# Altium schematic sheet nanobox_v31.SchDoc
size A; SheetNumber: 1; SheetTotal: 1
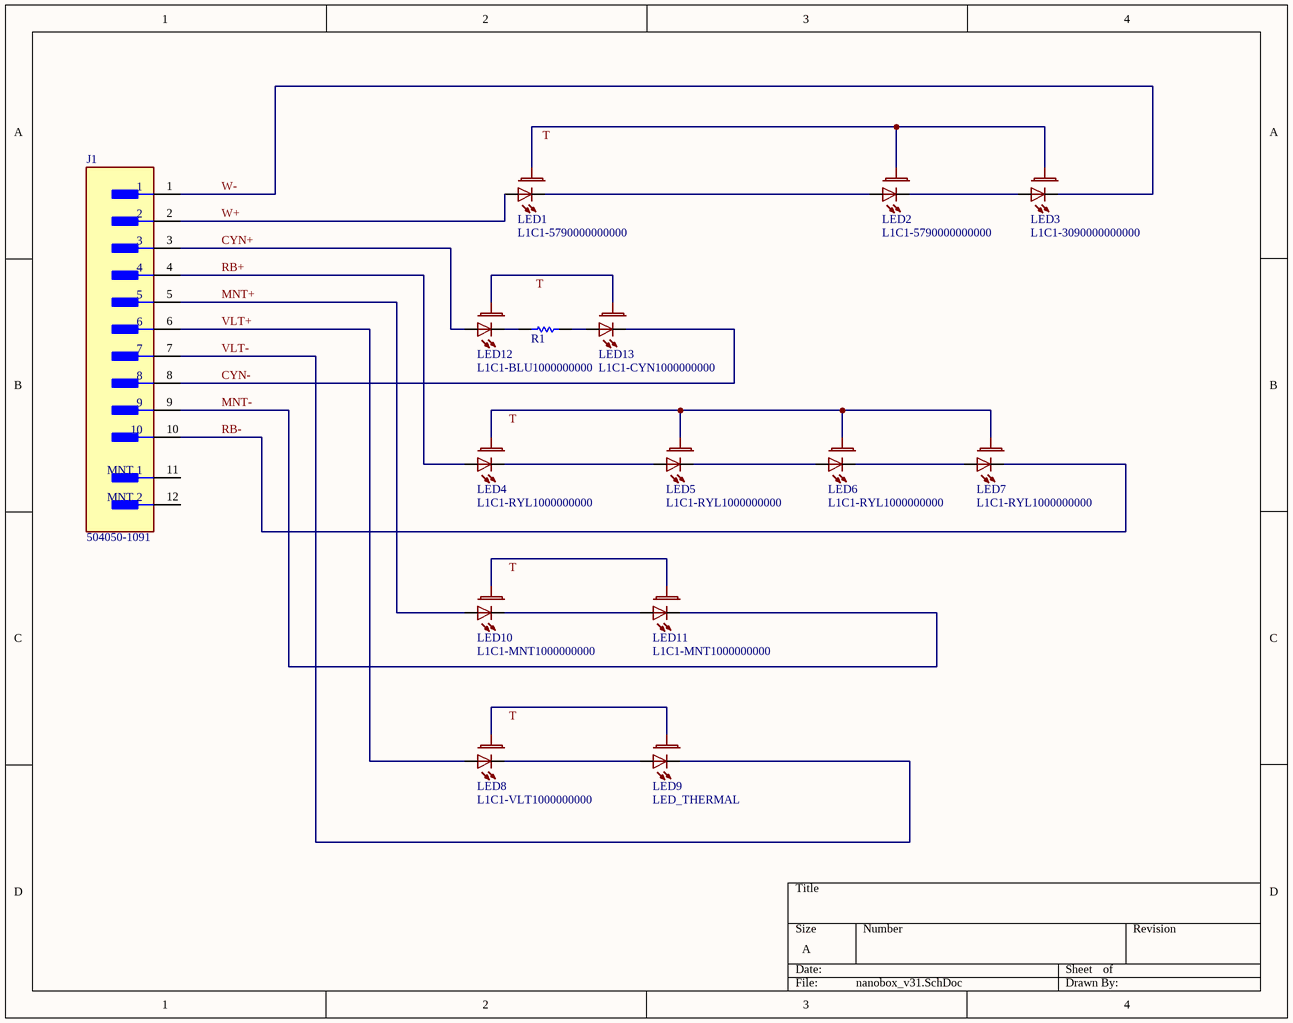
[diagram p0: nanobox_v31.SchDoc]

## Parts
J1  504050-1091  [FP-504050-1091-MFG]
LED1  L1C1-5790000000000  [LUXEON_C_WIDE]
LED2  L1C1-5790000000000  [LUXEON_C_WIDE]
LED3  L1C1-3090000000000  [LUXEON_C_WIDE]
LED4  L1C1-RYL1000000000  [LUXEON_C_WIDE]
LED5  L1C1-RYL1000000000  [LUXEON_C_WIDE]
LED6  L1C1-RYL1000000000  [LUXEON_C_WIDE]
LED7  L1C1-RYL1000000000  [LUXEON_C_WIDE]
LED8  L1C1-VLT1000000000  [LUXEON_C_WIDE]
LED9  LED_THERMAL  [VIOSYS_Z5]
LED10  L1C1-MNT1000000000  [LUXEON_C_WIDE]
LED11  L1C1-MNT1000000000  [LUXEON_C_WIDE]
LED12  L1C1-BLU1000000000  [LUXEON_C_WIDE]
LED13  L1C1-CYN1000000000  [LUXEON_C_WIDE]
R1  0R 2512 1W  [RESC2512(6432)_M]  (value not drawn)

## Nets
CYN+: J1.3 LED12.A
CYN-: J1.8 LED13.C
MNT+: J1.5 LED10.A
MNT-: J1.9 LED11.C
RB+: J1.4 LED4.A
RB-: J1.10 LED7.C
T: LED1.PAD LED2.PAD LED3.PAD LED4.PAD LED5.PAD LED6.PAD LED7.PAD LED8.PAD LED9.PAD LED10.PAD LED11.PAD LED12.PAD LED13.PAD
VLT+: J1.6 LED8.A
VLT-: J1.7 LED9.C
W+: J1.2 LED1.A
W-: J1.1 LED3.C
NetLED1_C: LED1.C LED2.A
NetLED2_C: LED2.C LED3.A
NetLED4_C: LED4.C LED5.A
NetLED5_C: LED5.C LED6.A
NetLED6_C: LED6.C LED7.A
NetLED8_C: LED8.C LED9.A
NetLED10_C: LED10.C LED11.A
NetLED12_C: LED12.C R1.2
NetLED13_A: LED13.A R1.1

Not connected (* = marked no-connect by the designer): J1 11(MNT_1) 12(MNT_2)

## Library data of the parts
J1 = CMP-002-00088-1: Conn Wire to Board HDR 10 POS 1.5mm Solder RA SMD Pico-Lock™ T/R
LED1 LED2 = CMP-007-00048-1: LUXEON C Color High Power LED Emitter Cool White 90 CRI 5700K 80 lm Min 350 mA; Color Rendering Index (CRI): 90; Forward Voltage: 2.75V; Dominant Wavelength: 590nm; Max Current Rating: 1.225A; Forward Current: 1.05A; Design Item ID: LED_THERMAL; Source: high-power-led.SCHLIB; Case/Package: SMD/SMT; Lead Free: Lead Free; Correlated Color Temperature (CCT): 5700K; Color: White
LED3 = CMP-007-00050-1: LED Chip Warm White 3000K 1225mA 2-Pin SMD T/R; Forward Voltage: 2.75V; Max Current Rating: 1.225A; Color Rendering Index (CRI): 90; Forward Current: 1.05A; Design Item ID: LED_THERMAL; Source: high-power-led.SCHLIB; Lead Free: Lead Free; Case/Package: SMD/SMT; Correlated Color Temperature (CCT): 3000k; Color: White
LED4-LED7 = CMP-007-00039-1: High Power LEDs - Single Color Royal Blue; Forward Voltage: 2.75V; Design Item ID: LED_THERMAL; Source: high-power-led.SCHLIB; Case/Package: SMD/SMT; Lead Free: Lead Free; Color: Blue
LED8 = CMP-007-00049-1: LED Uni-Color Violet 430nm 2-Pin SMD EP T/R; Forward Voltage: 3.5V; Dominant Wavelength: 425nm; Forward Current: 1.05A; Design Item ID: LED_THERMAL; Source: high-power-led.SCHLIB; Color: Violet; Lead Free: Lead Free; Case/Package: SMD/SMT; Max Current Rating: 1.05A
LED9 = CMP-124-0001-2: Design Item ID: LED_THERMAL; Source: high-power-led.SCHLIB
LED10 LED11 = CMP-007-00046-1: LUXEON C High Power Surface Mount LED Emitter Mint 350 mA 2.75 V; Forward Voltage: 2.75V; Dominant Wavelength: 475nm; Forward Current: 1.05A; Max Current Rating: 1.225A; Design Item ID: LED_THERMAL; Source: high-power-led.SCHLIB; Case/Package: SMD/SMT; Color: Mint; Lead Free: Lead Free
LED12 = CMP-007-00044-1: LED LUXEON BLUE 470NM L1; Forward Voltage: 2.9V; Dominant Wavelength: 475nm; Forward Current: 1.05A; Design Item ID: LED_THERMAL; Source: high-power-led.SCHLIB; Case/Package: SMD/SMT; Lead Free: Lead Free; Color: Blue
LED13 = CMP-007-00045-1: LUXEON C High Power Surface Mount LED Emitter Cyan 350 mA 2.6 V; Forward Current: 1.05A; Dominant Wavelength: 475nm; Forward Voltage: 2.6V; Design Item ID: LED_THERMAL; Source: high-power-led.SCHLIB; Case/Package: SMD/SMT; Color: Cyan; Lead Free: Lead Free
R1 = CMP-009-00214-1: Res Thick Film 2512 0 Ohm Molded SMD Automotive Blister T/R